# EAGLE design microscope-light-source (EAGLE 6.5.0)
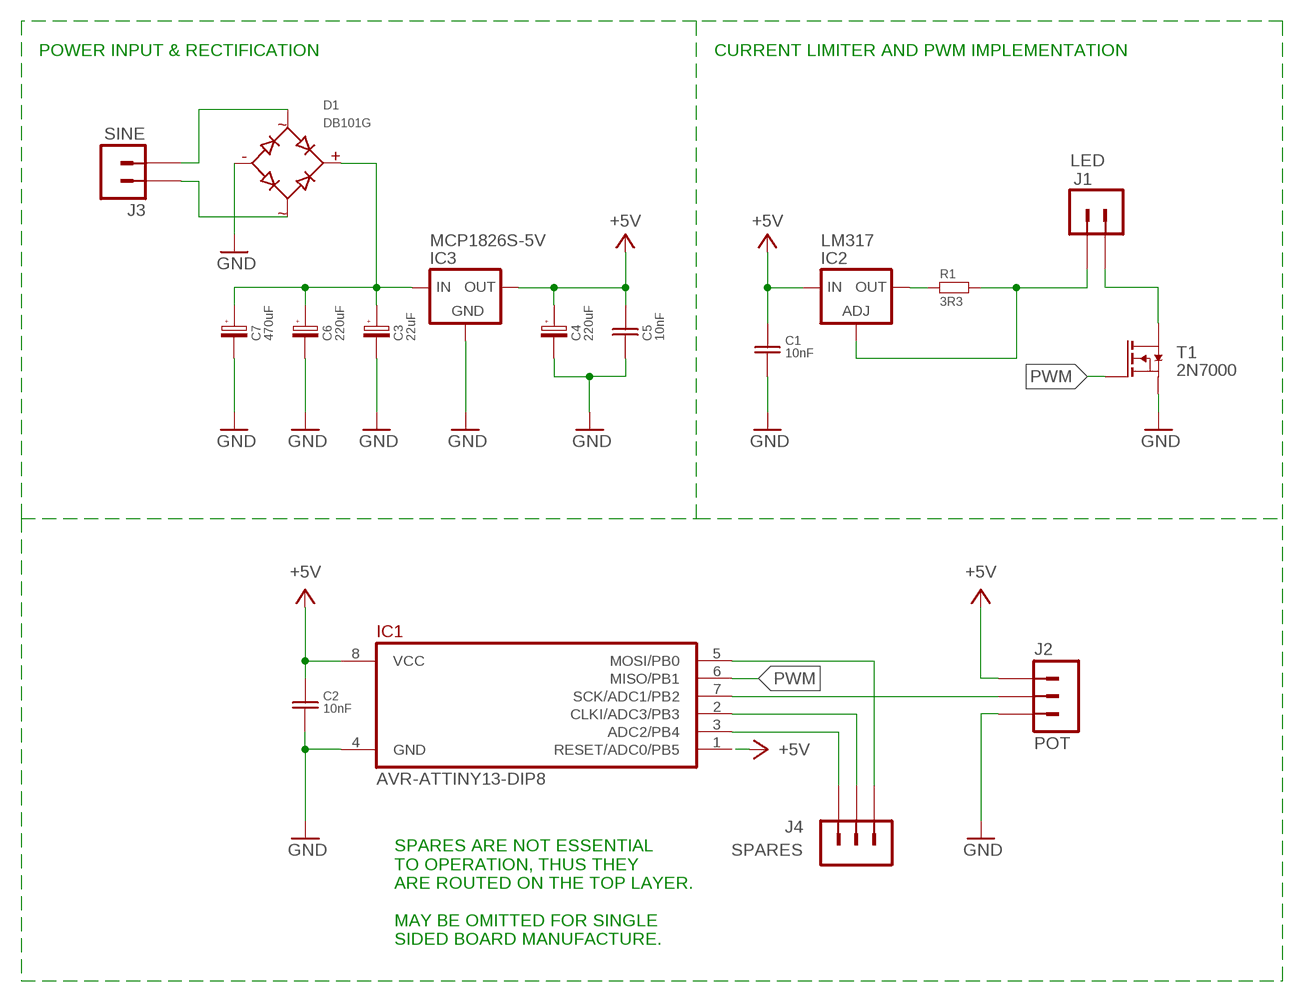
[diagram p0: schematic, sheet 1]

## Parts
C1  10nF  CAPACITOR-TH-5MM  [CAPACITOR-5MM-GRID]
C2  10nF  CAPACITOR-TH-5MM  [CAPACITOR-5MM-GRID]
C3  22uF  CAPACITOR-POLARISED-TH-5MM  [CAPACITOR-RADIAL-5MM]
C4  220uF  CAPACITOR-POLARISED-TH-5MM  [CAPACITOR-RADIAL-5MM]
C5  10nF  CAPACITOR-TH-5MM  [CAPACITOR-5MM-GRID]
C6  220uF  CAPACITOR-POLARISED-TH-5MM  [CAPACITOR-RADIAL-5MM]
C7  470uF  CAPACITOR-POLARISED-TH-10MM  [CAPACITOR-RADIAL-10MM]
D1  DB101G  DIODE-BRIDGE-RECTIFIER-DB101G  [DIL04-3-BRIDGE-RECTIFIER]
IC1  AVR-ATTINY13-DIP8  [DIL08-3]
IC2  LM317  VREG-3PIN-ADJ-AOI-TO220-HORZ-DRILL  [TO220-HORZ-DRILL]
IC3  MCP1826S-5V  VREG-3PIN-IGO-TO220-HORZ-DRILL  [TO220-HORZ-DRILL]
J1  LED  J02-LONG  [J02-LONG]
J2  POT  J03-LONG  [J03-LONG]
J3  SINE  J02-LONG  [J02-LONG]
J4  SPARES  J03-NOSILK  [J03-NOSILK]
R1  3R3  RESISTOR-TH-0410/9  [RESISTOR-4MMX10MM/9]
T1  2N7000  MOSFET-NCHAN-SGD-TO92-TRIANGLE  [TO92-TRIANGLE]

## Nets
+5V: C1.1 C2.1 C4.A C5.1 IC1.1(RESET/ADC0/PB5) IC1.8(VCC) IC2.3(IN) IC3.3(OUT) J2.1
GND: C1.2 C2.2 C3.C C4.C C5.2 C6.C C7.C D1.- IC1.4(GND) IC3.2(GND) J2.3 T1.1(SOURCE)
N$1: IC2.2(OUT) R1.2
N$2: IC2.1(ADJ) J1.1 R1.1
N$3: J1.2 T1.3(DRAIN)
N$4: IC1.3(ADC2/PB4) J4.3
N$5: IC1.7(SCK/ADC1/PB2) J2.2
N$6: IC1.2(CLKI/ADC3/PB3) J4.2
N$7: C3.A C6.A C7.A D1.+ IC3.1(IN)
N$8: D1.SINE0 J3.2
N$9: D1.SINE1 J3.1
N$10: IC1.5(MOSI/PB0) J4.1
PWM: IC1.6(MISO/PB1) T1.2(GATE)

## Notes on the sheet
- POWER INPUT & RECTIFICATION | CURRENT LIMITER AND PWM IMPLEMENTATION
- SPARES ARE NOT ESSENTIAL
  TO OPERATION, THUS THEY 
  ARE ROUTED ON THE TOP LAYER.
  
  MAY BE OMITTED FOR SINGLE
  SIDED BOARD MANUFACTURE.

## Library data of the parts
C1 C2 C5 = tidyeagle:CAPACITOR: Capacitors - Non-polarised
C3 C4 C6 C7 = tidyeagle:CAPACITOR-POLARISED: Capacitors - Polarised Typical sizes for through-hole capacitors - 5mm - 1µF to 47µF Your capacitors may vary, so check before fabrication.
D1 = tidyeagle:DIODE-BRIDGE-RECTIFIER
IC1 = tidyeagle:AVR-ATTINY13: Atmel 8-bit Microcontroller in DIP8 and SO8 packages. Datasheet: Summary <http://www.atmel.com/dyn/resources/prod_documents/2535S.pdf>, Full <http://www.atmel.com/dyn/resources/prod_documents/doc2535.pdf> Application Notes: AVR042 - Hardware Design Considerations <http://atmel.com/dyn/resources/prod_documents/doc2521.pdf>
IC2 = tidyeagle:VREG-3PIN-ADJ: Generic 3 Pin Adjustable Voltage Regulator Application note: You can use this LM317 calculator <http://www.electronics-lab.com/articles/LM317/> to find appropriate resistor values. Important: Note the pin connection and check against your datasheet. Pin 1 is the left most pin when looking down from the top of the package, as shown in the diagram on the right hand side. AOI (e.g. LM317) Pin 1 - Adjust/GND Pin 2 - Output Pin 3 - Input
IC3 = tidyeagle:VREG-3PIN: Generic 3 Pin Voltage Regulator For voltage regulators such as the LM7805 and similar. Horizontal TO220 packages are available with and without drill holes for mounting. Important: Note the pin connection and check against your datasheet. Pin 1 is the left most pin when looking down from the top of the package, as shown in the diagram on the right hand side. IGO (e.g. LM7805) Pin 1 - Input Pin 2 - GND Pin 3 - Output GOI (e.g. LD1086V33) Pin 1 - GND Pin 2 - Output Pin 3 - Input
J1 J3 = tidyeagle:J02: 2 Pin Header 0.1" (2.54mm) spacing.
J2 J4 = tidyeagle:J03: 3 Pin Header 0.1" (2.54mm) spacing.
R1 = tidyeagle:RESISTOR: Resistors
T1 = tidyeagle:MOSFET-NCHAN: N-Channel Mosfet TO92: The 'triangle' package is recommended if you are using with an insulating transistor pad. Important: Note the pin connection and check against your datasheet. Pin 1 is the left most pin when looking down from the top of the package, as shown in the diagram on the right hand side. This can vary from manufacturer to manufacturer even for the same part number! SGD (e.g. 2N7000) Pin 1 - Source Pin 2 - Gate Pin 3 - Drain

## Board
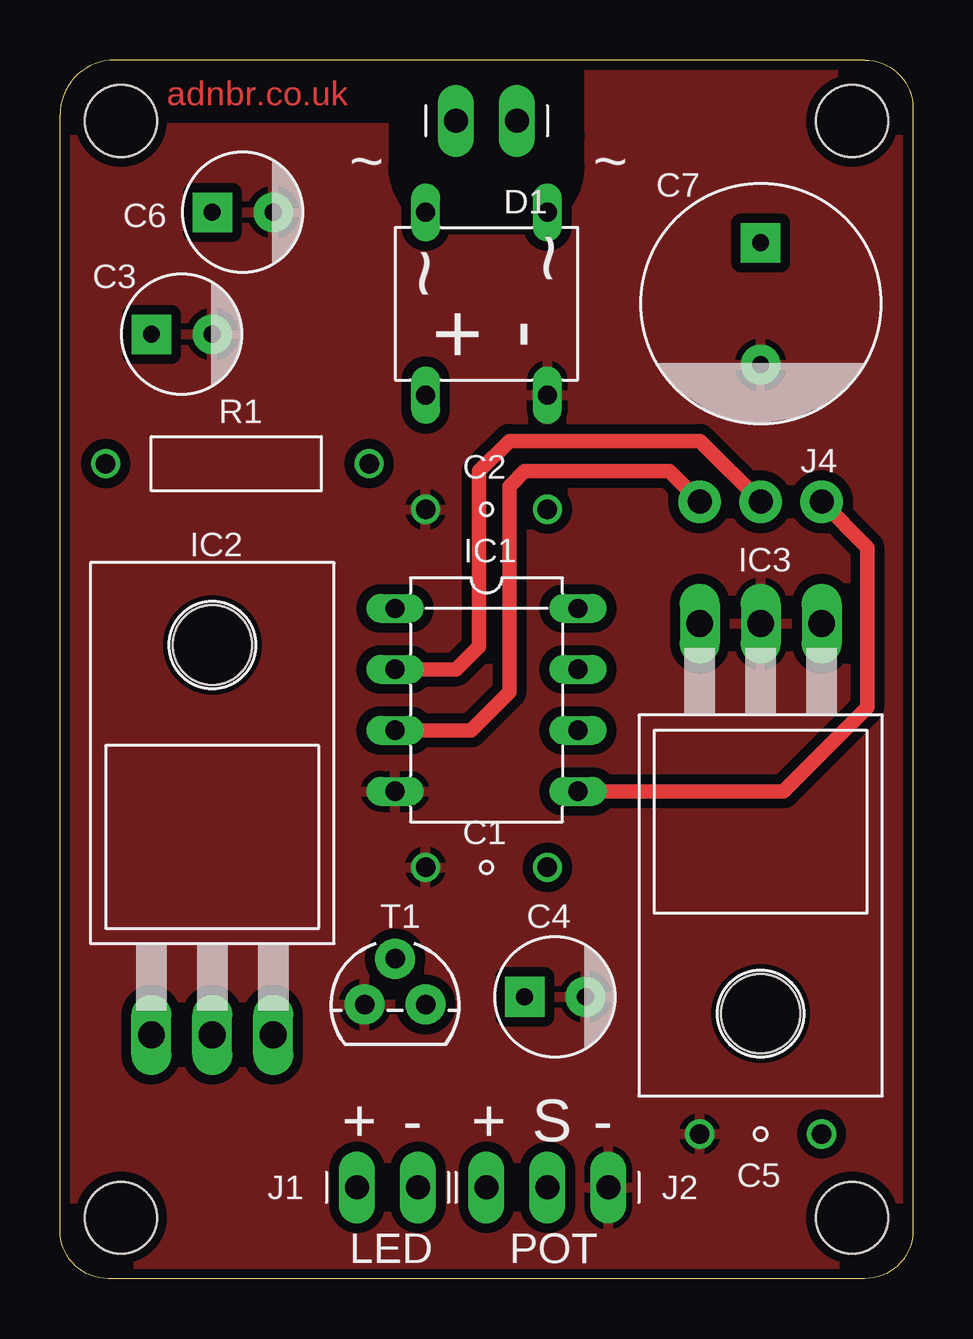
[diagram p1: board, top side]
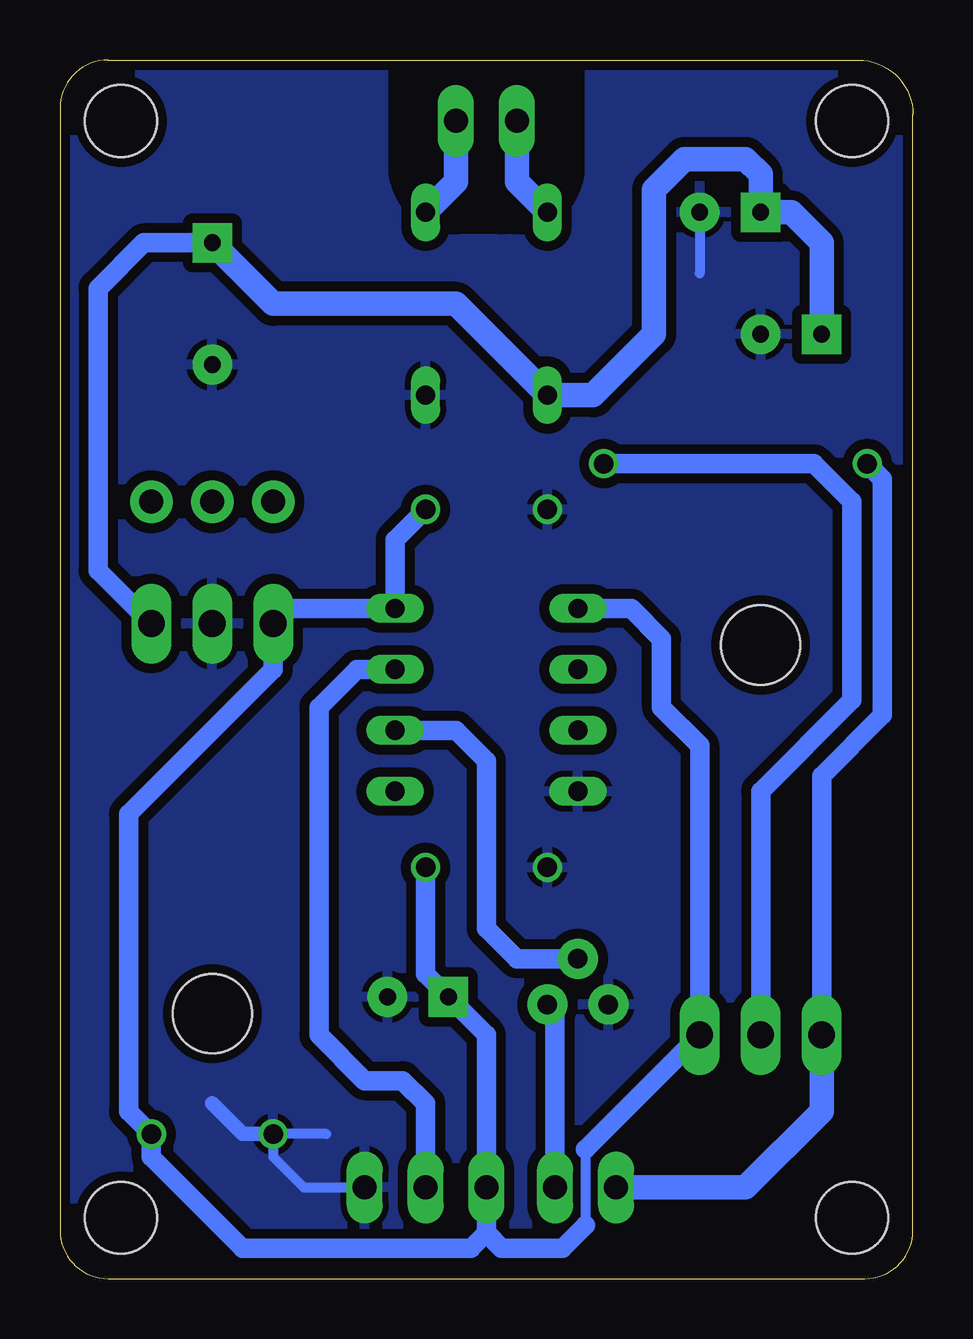
[diagram p2: board, bottom side, seen from below]

Size 35.56 x 50.8 mm. Coordinates in mm from the lower left corner, seen from the top.
Outline: 33.55,50.8 2.29,50.8 arc90 0,48.51 0,2.01 arc90 2.01,0 33.55,0 arc90 35.56,2.01 35.56,48.79 arc90 33.55,50.8
Copper layers (1*16): Top 0.0356mm / dielectric 1.5011mm / Bottom 0.0356mm
Design rules "LaenPCBOrder": minimum track width 6mil, minimum drill 13mil, track to track 6mil, track to pad 6mil, pad to pad 6mil, via to via 6mil, smd to smd 6mil, copper to edge 15mil, drill to drill 6mil, minimum pad ring 7mil, minimum via ring 7mil, stop-mask expansion 4mil, vias tented up to drill 0mil, thermal gap 10mil
Holes 3 mm at 2.54,2.54 2.54,48.26 33.02,2.54 33.02,48.26
tRestrict: area 14.6,44.5 to 21,50.8; area 4.4,48.6 to 13.7,48.9
bRestrict: area 14.6,44.5 to 21,50.8

### Footprints (pad centres in the part's own frame; a part is rotated, then mirrored left to right if it is on the bottom)
CAPACITOR-5MM-GRID = drill 0.813: 1 -2.54,0; 2 2.54,0
CAPACITOR-RADIAL-5MM = drill 0.7 pad 1.651 square: A 1.27,0 | drill 0.7 pad 1.651: C -1.27,0
CAPACITOR-RADIAL-10MM = drill 0.7 pad 1.651 square: A 2.54,0 | drill 0.7 pad 1.651: C -2.54,0
DIL04-3-BRIDGE-RECTIFIER = drill 0.8 long: + -3.81,-3.81; - 1.27,-3.81; SINE0 1.27,3.81; SINE1 -3.81,3.81
DIL08-3 = drill 0.8 long: 1 -3.81,-3.81; 2 -1.27,-3.81; 3 1.27,-3.81; 4 3.81,-3.81; 5 3.81,3.81; 6 1.27,3.81; 7 -1.27,3.81; 8 -3.81,3.81
TO220-HORZ-DRILL = drill 1.118 long: 1 -2.54,-8.89; 2 0,-8.89; 3 2.54,-8.89 | hole 3.302: 0,7.366
J02-LONG = drill 1 long: 1 0,0; 2 2.54,0
J03-LONG = drill 1 long: 1 0,0; 2 2.54,0; 3 5.08,0
J03-NOSILK = drill 1 pad 1.778: 1 0,0; 2 2.54,0; 3 5.08,0
RESISTOR-4MMX10MM/9 = drill 0.813: 1 0,0; 2 10.985,0
TO92-TRIANGLE = drill 0.813 pad 1.676: 1 -1.27,-1.27; 2 0,0.635; 3 1.27,-1.27

### Placement (x,y rotation side)
C1  17.78,17.14 180 top
C2  17.78,32.07 180 top
C3  5.08,39.37 180 top
C4  20.64,11.75 180 top
C5  29.21,6.03 180 top
C6  7.62,44.45 180 top
C7  29.21,40.64 90 top
D1  19.05,40.64 0 top
IC1  17.78,24.13 270 top
IC2  6.35,19.05 0 top
IC3  29.21,18.41 180 top
J1  12.38,3.81 0 top
J2  17.78,3.81 0 top
J3  16.51,48.26 0 top
J4  31.75,32.38 180 top
R1  1.91,33.97 0 top
T1  13.97,12.7 0 top

### Tracks (layer width: path | path; a pad name or v marks a point on that pad's centre or on a via)
+5V
  Bottom 0.406: 13.65,5.4 13.65,2.22
  Bottom 0.813: 13.65,2.22 14.61,1.27 17.14,1.27 17.78,1.91 | 17.78,1.91 18.41,1.27 27.94,1.27 31.75,5.08 C5.1 32.7,6.99 32.7,19.37 26.67,25.4 IC3.3 26.04,27.94 IC1.8 21.59,30.8 C2.1 | 17.78,1.91 J2.1 17.78,10.16 C4.A 20.32,12.7 C1.1 | 13.65,5.4 IC2.3 8.89,22.23 10.48,23.81 10.48,26.67 11.75,27.94 IC1.1
GND
  Bottom 0.406: C6.C 8.89,41.91 | J2.3 25.4,3.81 26.67,5.08 C5.2 24.45,6.03
  Bottom 0.61: C5.2 27.94,6.03 29.21,7.3
  pour Bottom (isolate 0.406): 0.32,50.48 35.24,50.48 35.24,0.32 0.32,0.32
  pour Top (isolate 0.406): 0,2.54 0,48.26 arc-90 2.54,50.8 16.51,50.8 33.66,50.8 arc-90 35.56,48.9 35.56,41.27 35.56,1.91 arc-90 33.66,0 22.23,0 1.91,0 arc-90 0,1.91
N$1
  Bottom 0.813: R1.2 4.13,33.97 2.54,32.38 2.54,24.13 6.35,20.32 IC2.2
N$2
  Bottom 0.813: IC2.1 3.81,20.95 1.27,23.5 1.27,33.34 R1.1
  Bottom 1.016: IC2.1 3.81,6.99 6.99,3.81 J1.1
N$3
  Bottom 0.813: T1.3 14.92,11.11 J1.2
N$4
  Top 0.61: J4.3 25.4,33.66 19.37,33.66 18.73,33.02 18.73,24.45 17.14,22.86 IC1.3
N$5
  Bottom 0.813: IC1.7 23.18,25.4 24.77,23.81 24.77,10.16 22.86,8.26 21.27,8.26 20.32,7.3 J2.2
N$6
  Top 0.61: IC1.2 16.51,25.4 17.46,26.35 17.46,33.66 18.73,34.92 26.67,34.92 J4.2
N$7
  Bottom 0.813: C7.A 32.07,43.18 33.97,41.27 33.97,29.53 IC3.1
  Bottom 1.016: C3.A 3.81,43.18 5.08,44.45 C6.A 6.35,46.04 6.99,46.67 9.53,46.67 10.79,45.4 10.79,39.37 13.34,36.83 D1.+ 19.05,40.64 26.67,40.64 C7.A
N$8
  Bottom 1.016: J3.2 19.05,45.72 D1.SINE0
N$9
  Bottom 1.016: J3.1 16.51,45.72 D1.SINE1
N$10
  Top 0.61: IC1.5 30.16,20.32 33.66,23.81 33.66,30.48 J4.1
PWM
  Bottom 0.813: T1.2 16.51,13.34 17.78,14.61 17.78,21.59 19.05,22.86 IC1.6

### Text on the board
Top: adnbr.co.uk
tPlace: ~ | ~ | + | - | + | S | - | LED | POT